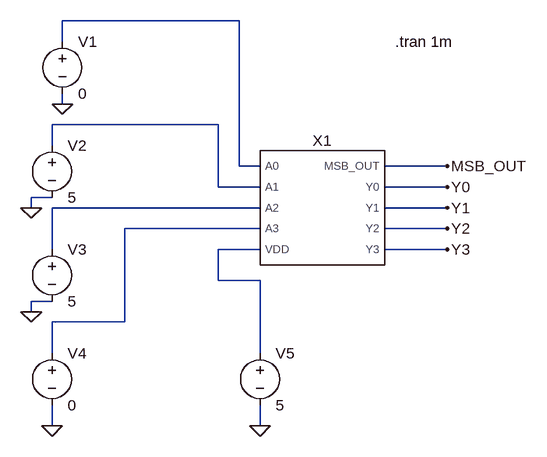
[diagram p0: schematic test_Shift4bit.asc]
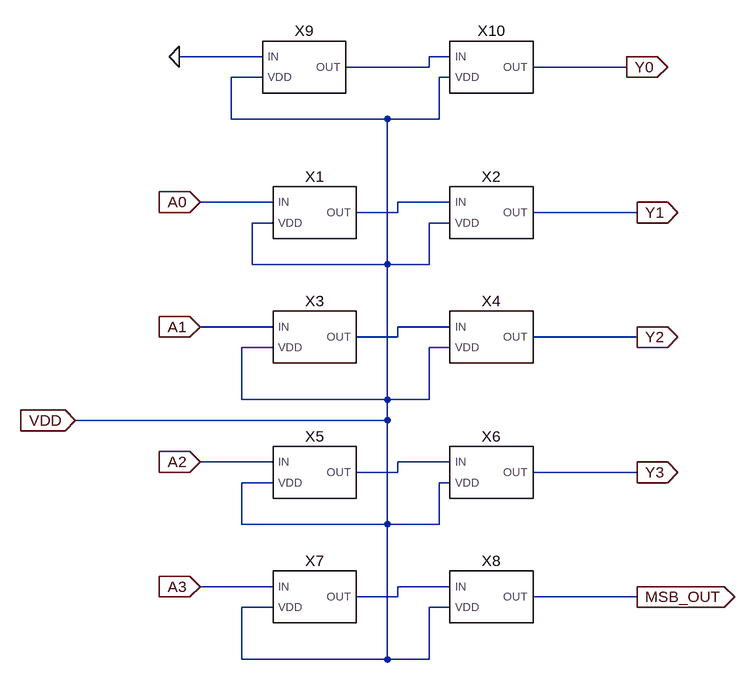
[diagram p1: sub-circuit shift4bit.asc]
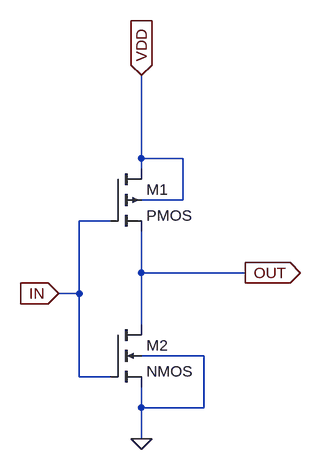
[diagram p2: sub-circuit not1.asc]
test_Shift4bit.asc, the LTspice schematic file:
Version 4.1
SHEET 1 880 680
WIRE 32 -160 -240 -160
WIRE -240 -128 -240 -160
WIRE -240 -32 -240 -48
WIRE 0 0 -256 0
WIRE -256 32 -256 0
WIRE 32 64 32 -160
WIRE 64 64 32 64
WIRE 352 64 256 64
WIRE 0 96 0 0
WIRE 64 96 0 96
WIRE 352 96 256 96
WIRE -256 112 -288 112
WIRE -288 128 -288 112
WIRE 64 128 -256 128
WIRE 352 128 256 128
WIRE 64 160 -144 160
WIRE 352 160 256 160
WIRE -256 192 -256 128
WIRE 64 192 0 192
WIRE 352 192 256 192
WIRE 0 240 0 192
WIRE 64 240 0 240
WIRE -256 272 -288 272
WIRE -288 288 -288 272
WIRE -144 304 -144 160
WIRE -144 304 -256 304
WIRE -256 352 -256 304
WIRE 64 352 64 240
WIRE -256 464 -256 432
WIRE 64 464 64 432
FLAG 352 64 MSB_OUT
FLAG 352 96 Y0
FLAG 352 128 Y1
FLAG 352 160 Y2
FLAG 352 192 Y3
FLAG -240 -32 0
FLAG -288 128 0
FLAG -288 288 0
FLAG -256 464 0
FLAG 64 464 0
SYMBOL Shift4bit 160 128 R0
SYMATTR InstName X1
SYMBOL voltage -240 -144 R0
WINDOW 123 0 0 Left 0
WINDOW 39 0 0 Left 0
SYMATTR InstName V1
SYMATTR Value 0
SYMBOL voltage -256 16 R0
WINDOW 123 0 0 Left 0
WINDOW 39 0 0 Left 0
SYMATTR InstName V2
SYMATTR Value 5
SYMBOL voltage -256 176 R0
WINDOW 123 0 0 Left 0
WINDOW 39 0 0 Left 0
SYMATTR InstName V3
SYMATTR Value 5
SYMBOL voltage -256 336 R0
WINDOW 123 0 0 Left 0
WINDOW 39 0 0 Left 0
SYMATTR InstName V4
SYMATTR Value 0
SYMBOL voltage 64 336 R0
WINDOW 123 0 0 Left 0
WINDOW 39 0 0 Left 0
SYMATTR InstName V5
SYMATTR Value 5
TEXT 272 -128 Left 2 !.tran 1m

shift4bit.asc, the sub-circuit schematic file:
Version 4.1
SHEET 1 880 824
WIRE 48 -112 -80 -112
WIRE 336 -112 304 -112
WIRE 304 -96 304 -112
WIRE 304 -96 176 -96
WIRE 608 -96 464 -96
WIRE 48 -80 0 -80
WIRE 336 -80 320 -80
WIRE 0 -16 0 -80
WIRE 240 -16 0 -16
WIRE 320 -16 320 -80
WIRE 320 -16 240 -16
WIRE 64 112 -48 112
WIRE 336 112 256 112
WIRE 256 128 256 112
WIRE 256 128 192 128
WIRE 624 128 464 128
WIRE 64 144 32 144
WIRE 336 144 304 144
WIRE 32 208 32 144
WIRE 240 208 240 -16
WIRE 240 208 32 208
WIRE 304 208 304 144
WIRE 304 208 240 208
WIRE 64 304 -48 304
WIRE 336 304 256 304
WIRE 256 320 256 304
WIRE 256 320 192 320
WIRE 624 320 464 320
WIRE 64 336 16 336
WIRE 336 336 304 336
WIRE 16 416 16 336
WIRE 240 416 240 208
WIRE 240 416 16 416
WIRE 304 416 304 336
WIRE 304 416 240 416
WIRE 240 448 240 416
WIRE 240 448 -240 448
WIRE 64 512 -48 512
WIRE 336 512 256 512
WIRE 256 528 256 512
WIRE 256 528 192 528
WIRE 624 528 464 528
WIRE 64 544 16 544
WIRE 336 544 320 544
WIRE 16 608 16 544
WIRE 240 608 240 448
WIRE 240 608 16 608
WIRE 320 608 320 544
WIRE 320 608 240 608
WIRE 64 704 -48 704
WIRE 336 704 256 704
WIRE 256 720 256 704
WIRE 256 720 192 720
WIRE 624 720 464 720
WIRE 64 736 16 736
WIRE 336 736 304 736
WIRE 16 816 16 736
WIRE 240 816 240 608
WIRE 240 816 16 816
WIRE 304 816 304 736
WIRE 304 816 240 816
FLAG -48 112 A0
IOPIN -48 112 In
FLAG -48 304 A1
IOPIN -48 304 In
FLAG -48 512 A2
IOPIN -48 512 In
FLAG -48 704 A3
IOPIN -48 704 In
FLAG 624 128 Y1
IOPIN 624 128 Out
FLAG 624 320 Y2
IOPIN 624 320 Out
FLAG 624 528 Y3
IOPIN 624 528 Out
FLAG 624 720 MSB_OUT
IOPIN 624 720 Out
FLAG -240 448 VDD
IOPIN -240 448 In
FLAG -80 -112 0
FLAG 608 -96 Y0
IOPIN 608 -96 Out
SYMBOL NOT1 128 128 R0
SYMATTR InstName X1
SYMBOL NOT1 400 128 R0
SYMATTR InstName X2
SYMBOL NOT1 128 320 R0
SYMATTR InstName X3
SYMBOL NOT1 400 320 R0
SYMATTR InstName X4
SYMBOL NOT1 128 528 R0
SYMATTR InstName X5
SYMBOL NOT1 400 528 R0
SYMATTR InstName X6
SYMBOL NOT1 128 720 R0
SYMATTR InstName X7
SYMBOL NOT1 400 720 R0
SYMATTR InstName X8
SYMBOL NOT1 112 -96 R0
SYMATTR InstName X9
SYMBOL NOT1 400 -96 R0
SYMATTR InstName X10

not1.asc, the sub-circuit schematic file:
Version 4.1
SHEET 1 880 680
WIRE 240 176 240 48
WIRE 304 176 240 176
WIRE 240 192 240 176
WIRE 304 240 304 176
WIRE 304 240 240 240
WIRE 192 272 144 272
WIRE 240 352 240 288
WIRE 400 352 240 352
WIRE 144 384 144 272
WIRE 144 384 112 384
WIRE 240 432 240 352
WIRE 336 480 240 480
WIRE 144 512 144 384
WIRE 192 512 144 512
WIRE 240 560 240 528
WIRE 336 560 336 480
WIRE 336 560 240 560
WIRE 240 608 240 560
FLAG 240 608 0
FLAG 112 384 IN
IOPIN 112 384 In
FLAG 400 352 OUT
IOPIN 400 352 Out
FLAG 240 48 VDD
IOPIN 240 48 In
SYMBOL pmos4 192 192 R0
SYMATTR InstName M1
SYMBOL nmos4 192 432 R0
SYMATTR InstName M2

The netlist it stands for:
* test_Shift4bit.asc
X§X1 N001 N002 N003 N004 N005 MSB_OUT Y0 Y1 Y2 Y3 shift4bit
V1 N001 0 0
V2 N002 0 5
V3 N003 0 5
V4 N004 0 0
V5 N005 0 5

* block symbol definitions
.subckt shift4bit A0 A1 A2 A3 VDD MSB_OUT Y0 Y1 Y2 Y3
X§X1 A0 VDD N002 not1
X§X2 N002 VDD Y1 not1
X§X3 A1 VDD N003 not1
X§X4 N003 VDD Y2 not1
X§X5 A2 VDD N004 not1
X§X6 N004 VDD Y3 not1
X§X7 A3 VDD N005 not1
X§X8 N005 VDD MSB_OUT not1
X§X9 0 VDD N001 not1
X§X10 N001 VDD Y0 not1
.ends shift4bit

.subckt not1 IN VDD OUT
M1 VDD IN OUT VDD PMOS
M2 OUT IN 0 0 NMOS
.ends not1

.model NMOS NMOS
.model PMOS PMOS
.lib standard.mos
.tran 1m
.backanno
.end